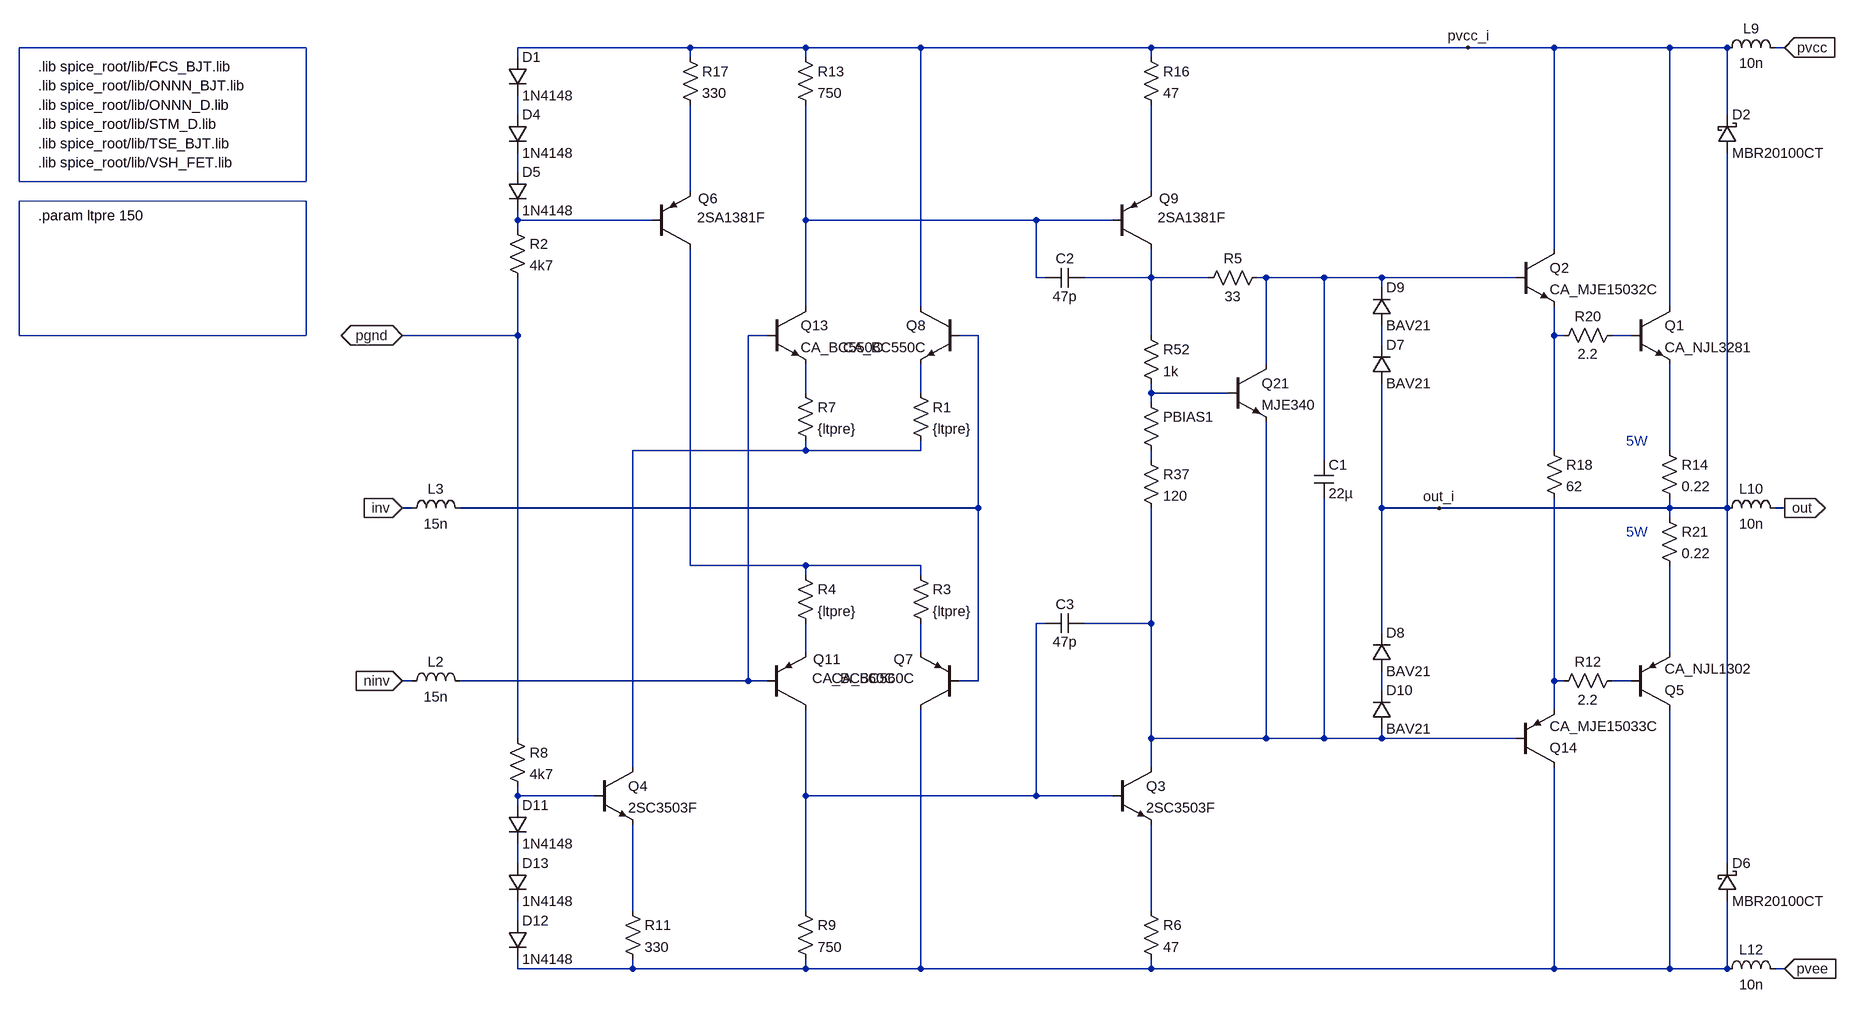
[diagram p0: schematic pab3bbb-harmonious-module.asc]
pab3bbb-harmonious-module.asc, the LTspice schematic file:
Version 4
SHEET 1 6124 2336
WIRE 576 -992 288 -992
WIRE 768 -992 576 -992
WIRE 960 -992 768 -992
WIRE 1344 -992 960 -992
WIRE 1872 -992 1344 -992
WIRE 2016 -992 1872 -992
WIRE 2208 -992 2016 -992
WIRE 2304 -992 2208 -992
WIRE 2400 -992 2384 -992
WIRE 288 -976 288 -992
WIRE 576 -976 576 -992
WIRE 768 -976 768 -992
WIRE 1344 -976 1344 -992
WIRE 288 -880 288 -912
WIRE 2304 -880 2304 -992
WIRE 288 -784 288 -816
WIRE 576 -752 576 -896
WIRE 1344 -752 1344 -896
WIRE 288 -704 288 -720
WIRE 512 -704 288 -704
WIRE 768 -704 768 -896
WIRE 1152 -704 768 -704
WIRE 1280 -704 1152 -704
WIRE 288 -688 288 -704
WIRE 2016 -656 2016 -992
WIRE 1152 -608 1152 -704
WIRE 1168 -608 1152 -608
WIRE 1344 -608 1344 -656
WIRE 1344 -608 1232 -608
WIRE 1440 -608 1344 -608
WIRE 1536 -608 1520 -608
WIRE 1632 -608 1536 -608
WIRE 1728 -608 1632 -608
WIRE 1952 -608 1728 -608
WIRE 1728 -592 1728 -608
WIRE 768 -560 768 -704
WIRE 960 -560 960 -992
WIRE 2208 -560 2208 -992
WIRE 288 -512 288 -608
WIRE 288 -512 96 -512
WIRE 704 -512 672 -512
WIRE 1056 -512 1024 -512
WIRE 1344 -512 1344 -608
WIRE 2016 -512 2016 -560
WIRE 2032 -512 2016 -512
WIRE 2144 -512 2112 -512
WIRE 1728 -496 1728 -528
WIRE 1536 -464 1536 -608
WIRE 768 -416 768 -464
WIRE 960 -416 960 -464
WIRE 1344 -416 1344 -432
WIRE 1472 -416 1344 -416
WIRE 1344 -400 1344 -416
WIRE 768 -320 768 -336
WIRE 768 -320 480 -320
WIRE 960 -320 960 -336
WIRE 960 -320 768 -320
WIRE 2016 -320 2016 -512
WIRE 2208 -320 2208 -464
WIRE 1344 -304 1344 -320
WIRE 1632 -304 1632 -608
WIRE 112 -224 96 -224
WIRE 1056 -224 1056 -512
WIRE 1056 -224 192 -224
WIRE 1728 -224 1728 -432
WIRE 1824 -224 1728 -224
WIRE 2208 -224 2208 -240
WIRE 2208 -224 1824 -224
WIRE 2304 -224 2304 -816
WIRE 2304 -224 2208 -224
WIRE 2400 -224 2384 -224
WIRE 2208 -208 2208 -224
WIRE 576 -128 576 -656
WIRE 768 -128 576 -128
WIRE 960 -128 768 -128
WIRE 768 -112 768 -128
WIRE 960 -112 960 -128
WIRE 1168 -32 1152 -32
WIRE 1344 -32 1344 -224
WIRE 1344 -32 1232 -32
WIRE 1728 -16 1728 -224
WIRE 768 16 768 -32
WIRE 960 16 960 -32
WIRE 2208 16 2208 -128
WIRE 112 64 96 64
WIRE 672 64 672 -512
WIRE 672 64 192 64
WIRE 704 64 672 64
WIRE 1056 64 1056 -224
WIRE 1056 64 1024 64
WIRE 2016 64 2016 -240
WIRE 2032 64 2016 64
WIRE 2144 64 2112 64
WIRE 1728 80 1728 48
WIRE 2016 112 2016 64
WIRE 288 160 288 -512
WIRE 1344 160 1344 -32
WIRE 1536 160 1536 -368
WIRE 1536 160 1344 160
WIRE 1632 160 1632 -240
WIRE 1632 160 1536 160
WIRE 1728 160 1728 144
WIRE 1728 160 1632 160
WIRE 1952 160 1728 160
WIRE 480 208 480 -320
WIRE 1344 208 1344 160
WIRE 288 256 288 240
WIRE 416 256 288 256
WIRE 768 256 768 112
WIRE 1152 256 1152 -32
WIRE 1152 256 768 256
WIRE 1280 256 1152 256
WIRE 288 272 288 256
WIRE 288 368 288 336
WIRE 2304 368 2304 -224
WIRE 480 448 480 304
WIRE 768 448 768 256
WIRE 1344 448 1344 304
WIRE 288 464 288 432
WIRE 288 544 288 528
WIRE 480 544 480 528
WIRE 480 544 288 544
WIRE 768 544 768 528
WIRE 768 544 480 544
WIRE 960 544 960 112
WIRE 960 544 768 544
WIRE 1344 544 1344 528
WIRE 1344 544 960 544
WIRE 2016 544 2016 208
WIRE 2016 544 1344 544
WIRE 2208 544 2208 112
WIRE 2208 544 2016 544
WIRE 2304 544 2304 432
WIRE 2304 544 2208 544
WIRE 2400 544 2384 544
FLAG 2400 -992 pvcc
IOPIN 2400 -992 In
FLAG 2400 544 pvee
IOPIN 2400 544 In
FLAG 2400 -224 out
IOPIN 2400 -224 Out
FLAG 96 64 ninv
IOPIN 96 64 In
FLAG 96 -224 inv
IOPIN 96 -224 In
FLAG 1872 -992 pvcc_i
FLAG 1824 -224 out_i
FLAG 96 -512 pgnd
IOPIN 96 -512 BiDir
SYMBOL pnp 704 112 M180
WINDOW 0 77 84 Left 2
WINDOW 3 75 52 Left 2
SYMATTR InstName Q11
SYMATTR Value CA_BC560C
SYMBOL res 1328 -992 R0
SYMATTR InstName R16
SYMATTR Value 47
SYMBOL res 1328 -416 R0
WINDOW 3 36 76 Invisible 2
SYMATTR Value {1+(500*BIAS)}
SYMATTR InstName PBIAS1
SYMBOL res 1328 -528 R0
SYMATTR InstName R52
SYMATTR Value 1k
SYMBOL npn 1280 208 R0
SYMATTR InstName Q3
SYMATTR Value 2SC3503F
SYMBOL res 1328 432 R0
SYMATTR InstName R6
SYMATTR Value 47
SYMBOL pnp 1024 112 R180
WINDOW 0 77 84 Left 2
WINDOW 3 75 52 Left 2
SYMATTR InstName Q7
SYMATTR Value CA_BC560C
SYMBOL npn 1472 -464 R0
SYMATTR InstName Q21
SYMATTR Value MJE340
SYMBOL res 1328 -320 R0
SYMATTR InstName R37
SYMATTR Value 120
SYMBOL res 2192 -336 R0
SYMATTR InstName R14
SYMATTR Value 0.22
SYMBOL res 2192 -224 R0
SYMATTR InstName R21
SYMATTR Value 0.22
SYMBOL ind 96 80 R270
WINDOW 0 32 56 VTop 2
WINDOW 3 5 56 VBottom 2
SYMATTR InstName L2
SYMATTR Value 15n
SYMATTR SpiceLine Rser=20m
SYMBOL ind 96 -208 R270
WINDOW 0 32 56 VTop 2
WINDOW 3 5 56 VBottom 2
SYMATTR InstName L3
SYMATTR Value 15n
SYMATTR SpiceLine Rser=20m
SYMBOL ind 2288 -208 R270
WINDOW 0 32 56 VTop 2
WINDOW 3 5 56 VBottom 2
SYMATTR InstName L10
SYMATTR Value 10n
SYMATTR SpiceLine Rser=10m
SYMBOL ind 2288 -976 R270
WINDOW 0 32 56 VTop 2
WINDOW 3 5 56 VBottom 2
SYMATTR InstName L9
SYMATTR Value 10n
SYMATTR SpiceLine Rser=10m
SYMBOL ind 2288 560 R270
WINDOW 0 32 56 VTop 2
WINDOW 3 5 56 VBottom 2
SYMATTR InstName L12
SYMATTR Value 10n
SYMATTR SpiceLine Rser=10m
SYMBOL pnp 1280 -656 M180
WINDOW 0 77 84 Left 2
WINDOW 3 75 52 Left 2
SYMATTR InstName Q9
SYMATTR Value 2SA1381F
SYMBOL diode 1712 -528 M180
WINDOW 0 24 64 Left 2
WINDOW 3 24 0 Left 2
SYMATTR InstName D9
SYMATTR Value BAV21
SYMBOL diode 1712 144 M180
WINDOW 0 24 64 Left 2
WINDOW 3 24 0 Left 2
SYMATTR InstName D10
SYMATTR Value BAV21
SYMBOL cap 1616 -304 R0
SYMATTR InstName C1
SYMATTR Value 22µ
SYMATTR SpiceLine Rser=220m Lser=5n Rpar=800k Cpar=1p
SYMBOL res 752 -128 R0
SYMATTR InstName R4
SYMATTR Value {ltpre}
SYMBOL cap 1232 -48 R90
WINDOW 0 0 32 VBottom 2
WINDOW 3 32 32 VTop 2
SYMATTR InstName C3
SYMATTR Value 47p
SYMATTR SpiceLine Rser=970m Lser=5n Rpar=2meg Cpar=1p
SYMBOL res 944 -128 R0
SYMATTR InstName R3
SYMATTR Value {ltpre}
SYMBOL pnp 512 -656 M180
WINDOW 0 77 84 Left 2
WINDOW 3 75 52 Left 2
SYMATTR InstName Q6
SYMATTR Value 2SA1381F
SYMBOL npn 1024 -560 M0
SYMATTR InstName Q8
SYMATTR Value CA_BC550C
SYMBOL npn 704 -560 R0
SYMATTR InstName Q13
SYMATTR Value CA_BC550C
SYMBOL res 272 -704 R0
SYMATTR InstName R2
SYMATTR Value 4k7
SYMBOL res 560 -992 R0
SYMATTR InstName R17
SYMATTR Value 330
SYMBOL res 752 432 R0
SYMATTR InstName R9
SYMATTR Value 750
SYMBOL npn 2144 -560 R0
SYMATTR InstName Q1
SYMATTR Value CA_NJL3281
SYMBOL npn 1952 -656 R0
SYMATTR InstName Q2
SYMATTR Value CA_MJE15032C
SYMBOL pnp 2144 112 M180
SYMATTR InstName Q5
SYMATTR Value CA_NJL1302
SYMBOL pnp 1952 208 M180
SYMATTR InstName Q14
SYMATTR Value CA_MJE15033C
SYMBOL res 1536 -624 R90
WINDOW 0 0 56 VBottom 2
WINDOW 3 32 56 VTop 2
SYMATTR InstName R5
SYMATTR Value 33
SYMBOL diode 272 -880 R0
SYMATTR InstName D4
SYMATTR Value 1N4148
SYMBOL diode 272 -784 R0
SYMATTR InstName D5
SYMATTR Value 1N4148
SYMBOL res 2000 -336 R0
SYMATTR InstName R18
SYMATTR Value 62
SYMBOL res 2128 48 R90
WINDOW 0 0 56 VBottom 2
WINDOW 3 32 56 VTop 2
SYMATTR InstName R12
SYMATTR Value 2.2
SYMBOL res 2128 -528 R90
WINDOW 0 0 56 VBottom 2
WINDOW 3 32 56 VTop 2
SYMATTR InstName R20
SYMATTR Value 2.2
SYMBOL diode 272 -976 R0
SYMATTR InstName D1
SYMATTR Value 1N4148
SYMBOL schottky 2288 -816 M180
WINDOW 0 24 64 Left 2
WINDOW 3 24 0 Left 2
SYMATTR InstName D2
SYMATTR Value MBR20100CT
SYMATTR Description Diode
SYMATTR Type diode
SYMBOL schottky 2288 432 M180
WINDOW 0 24 64 Left 2
WINDOW 3 24 0 Left 2
SYMATTR InstName D6
SYMATTR Value MBR20100CT
SYMATTR Description Diode
SYMATTR Type diode
SYMBOL diode 1712 -432 M180
WINDOW 0 24 64 Left 2
WINDOW 3 24 0 Left 2
SYMATTR InstName D7
SYMATTR Value BAV21
SYMBOL diode 1712 48 M180
WINDOW 0 24 64 Left 2
WINDOW 3 24 0 Left 2
SYMATTR InstName D8
SYMATTR Value BAV21
SYMBOL res 944 -432 R0
SYMATTR InstName R1
SYMATTR Value {ltpre}
SYMBOL res 752 -432 R0
SYMATTR InstName R7
SYMATTR Value {ltpre}
SYMBOL npn 416 208 R0
SYMATTR InstName Q4
SYMATTR Value 2SC3503F
SYMBOL res 272 144 R0
SYMATTR InstName R8
SYMATTR Value 4k7
SYMBOL diode 272 272 R0
SYMATTR InstName D11
SYMATTR Value 1N4148
SYMBOL diode 272 464 R0
SYMATTR InstName D12
SYMATTR Value 1N4148
SYMBOL diode 272 368 R0
SYMATTR InstName D13
SYMATTR Value 1N4148
SYMBOL res 464 432 R0
SYMATTR InstName R11
SYMATTR Value 330
SYMBOL res 752 -992 R0
SYMATTR InstName R13
SYMATTR Value 750
SYMBOL cap 1232 -624 R90
WINDOW 0 0 32 VBottom 2
WINDOW 3 32 32 VTop 2
SYMATTR InstName C2
SYMATTR Value 47p
SYMATTR SpiceLine Rser=970m Lser=5n Rpar=2meg Cpar=1p
TEXT 2136 -336 Left 2 ;5W
TEXT 2136 -184 Left 2 ;5W
TEXT -864 -928 Left 2 !.lib spice_root/lib/ONNN_BJT.lib
TEXT -864 -864 Left 2 !.lib spice_root/lib/STM_D.lib
TEXT -864 -960 Left 2 !.lib spice_root/lib/FCS_BJT.lib
TEXT -864 -896 Left 2 !.lib spice_root/lib/ONNN_D.lib
TEXT -864 -832 Left 2 !.lib spice_root/lib/TSE_BJT.lib
TEXT -864 -800 Left 2 !.lib spice_root/lib/VSH_FET.lib
TEXT -864 -712 Left 2 !.param ltpre 150
RECTANGLE Normal -64 -768 -896 -992
RECTANGLE Normal -64 -512 -896 -736

The netlist it stands for:
* pab3bbb-harmonious-module.asc
Q11 N021 N009 N023 0 CA_BC560C
R16 pvcc_i N004 47
R§PBIAS1 N016 N019 {1+(500*BIAS)}
R52 N007 N016 1k
Q3 N022 N021 N032 0 2SC3503F
R6 N032 N034 47
Q7 N034 N010 N024 0 CA_BC560C
Q21 N008 N016 N022 0 MJE340
R37 N019 N022 120
R14 N018 out_i 0.22
R21 out_i N025 0.22
L2 ninv N009 15n Rser=20m
L3 inv N010 15n Rser=20m
L10 out_i out 10n Rser=10m
L9 pvcc_i pvcc 10n Rser=10m
L12 N034 pvee 10n Rser=10m
Q9 N007 N006 N004 0 2SA1381F
D9 N013 N008 BAV21
D10 N022 N028 BAV21
C1 N008 N022 22µ Rser=220m Lser=5n Rpar=800k Cpar=1p
R4 N020 N023 {ltpre}
C3 N022 N021 47p Rser=970m Lser=5n Rpar=2meg Cpar=1p
R3 N020 N024 {ltpre}
Q6 N020 N005 N003 0 2SA1381F
Q8 pvcc_i N010 N015 0 CA_BC550C
Q13 N006 N009 N014 0 CA_BC550C
R2 N005 pgnd 4k7
R17 pvcc_i N003 330
R9 N021 N034 750
Q1 pvcc_i N012 N018 0 CA_NJL3281
Q2 pvcc_i N008 N011 0 CA_MJE15032C
Q5 N034 N027 N025 0 CA_NJL1302
Q14 N034 N022 N026 0 CA_MJE15033C
R5 N008 N007 33
D4 N001 N002 1N4148
D5 N002 N005 1N4148
R18 N011 N026 62
R12 N027 N026 2.2
R20 N012 N011 2.2
D1 pvcc_i N001 1N4148
D2 out_i pvcc_i MBR20100CT
D6 N034 out_i MBR20100CT
D7 out_i N013 BAV21
D8 N028 out_i BAV21
R1 N015 N017 {ltpre}
R7 N014 N017 {ltpre}
Q4 N017 N029 N031 0 2SC3503F
R8 pgnd N029 4k7
D11 N029 N030 1N4148
D12 N033 N034 1N4148
D13 N030 N033 1N4148
R11 N031 N034 330
R13 pvcc_i N006 750
C2 N007 N006 47p Rser=970m Lser=5n Rpar=2meg Cpar=1p
.model D D
.lib standard.dio
.model NPN NPN
.model PNP PNP
.lib standard.bjt
* 5W
* 5W
.lib spice_root/lib/ONNN_BJT.lib
.lib spice_root/lib/STM_D.lib
.lib spice_root/lib/FCS_BJT.lib
.lib spice_root/lib/ONNN_D.lib
.lib spice_root/lib/TSE_BJT.lib
.lib spice_root/lib/VSH_FET.lib
.param ltpre 150
.backanno
.end